# Altium schematic sheet pca10201_power_supply.SchDoc: =BoardTitle + ' - Power Supply'
size A3; Organization: Nordic Semiconductor; DocumentNumber: 8; SheetNumber: 8; SheetTotal: 10; CompanyName: Nordic Semiconductor; DocumentSize: A3
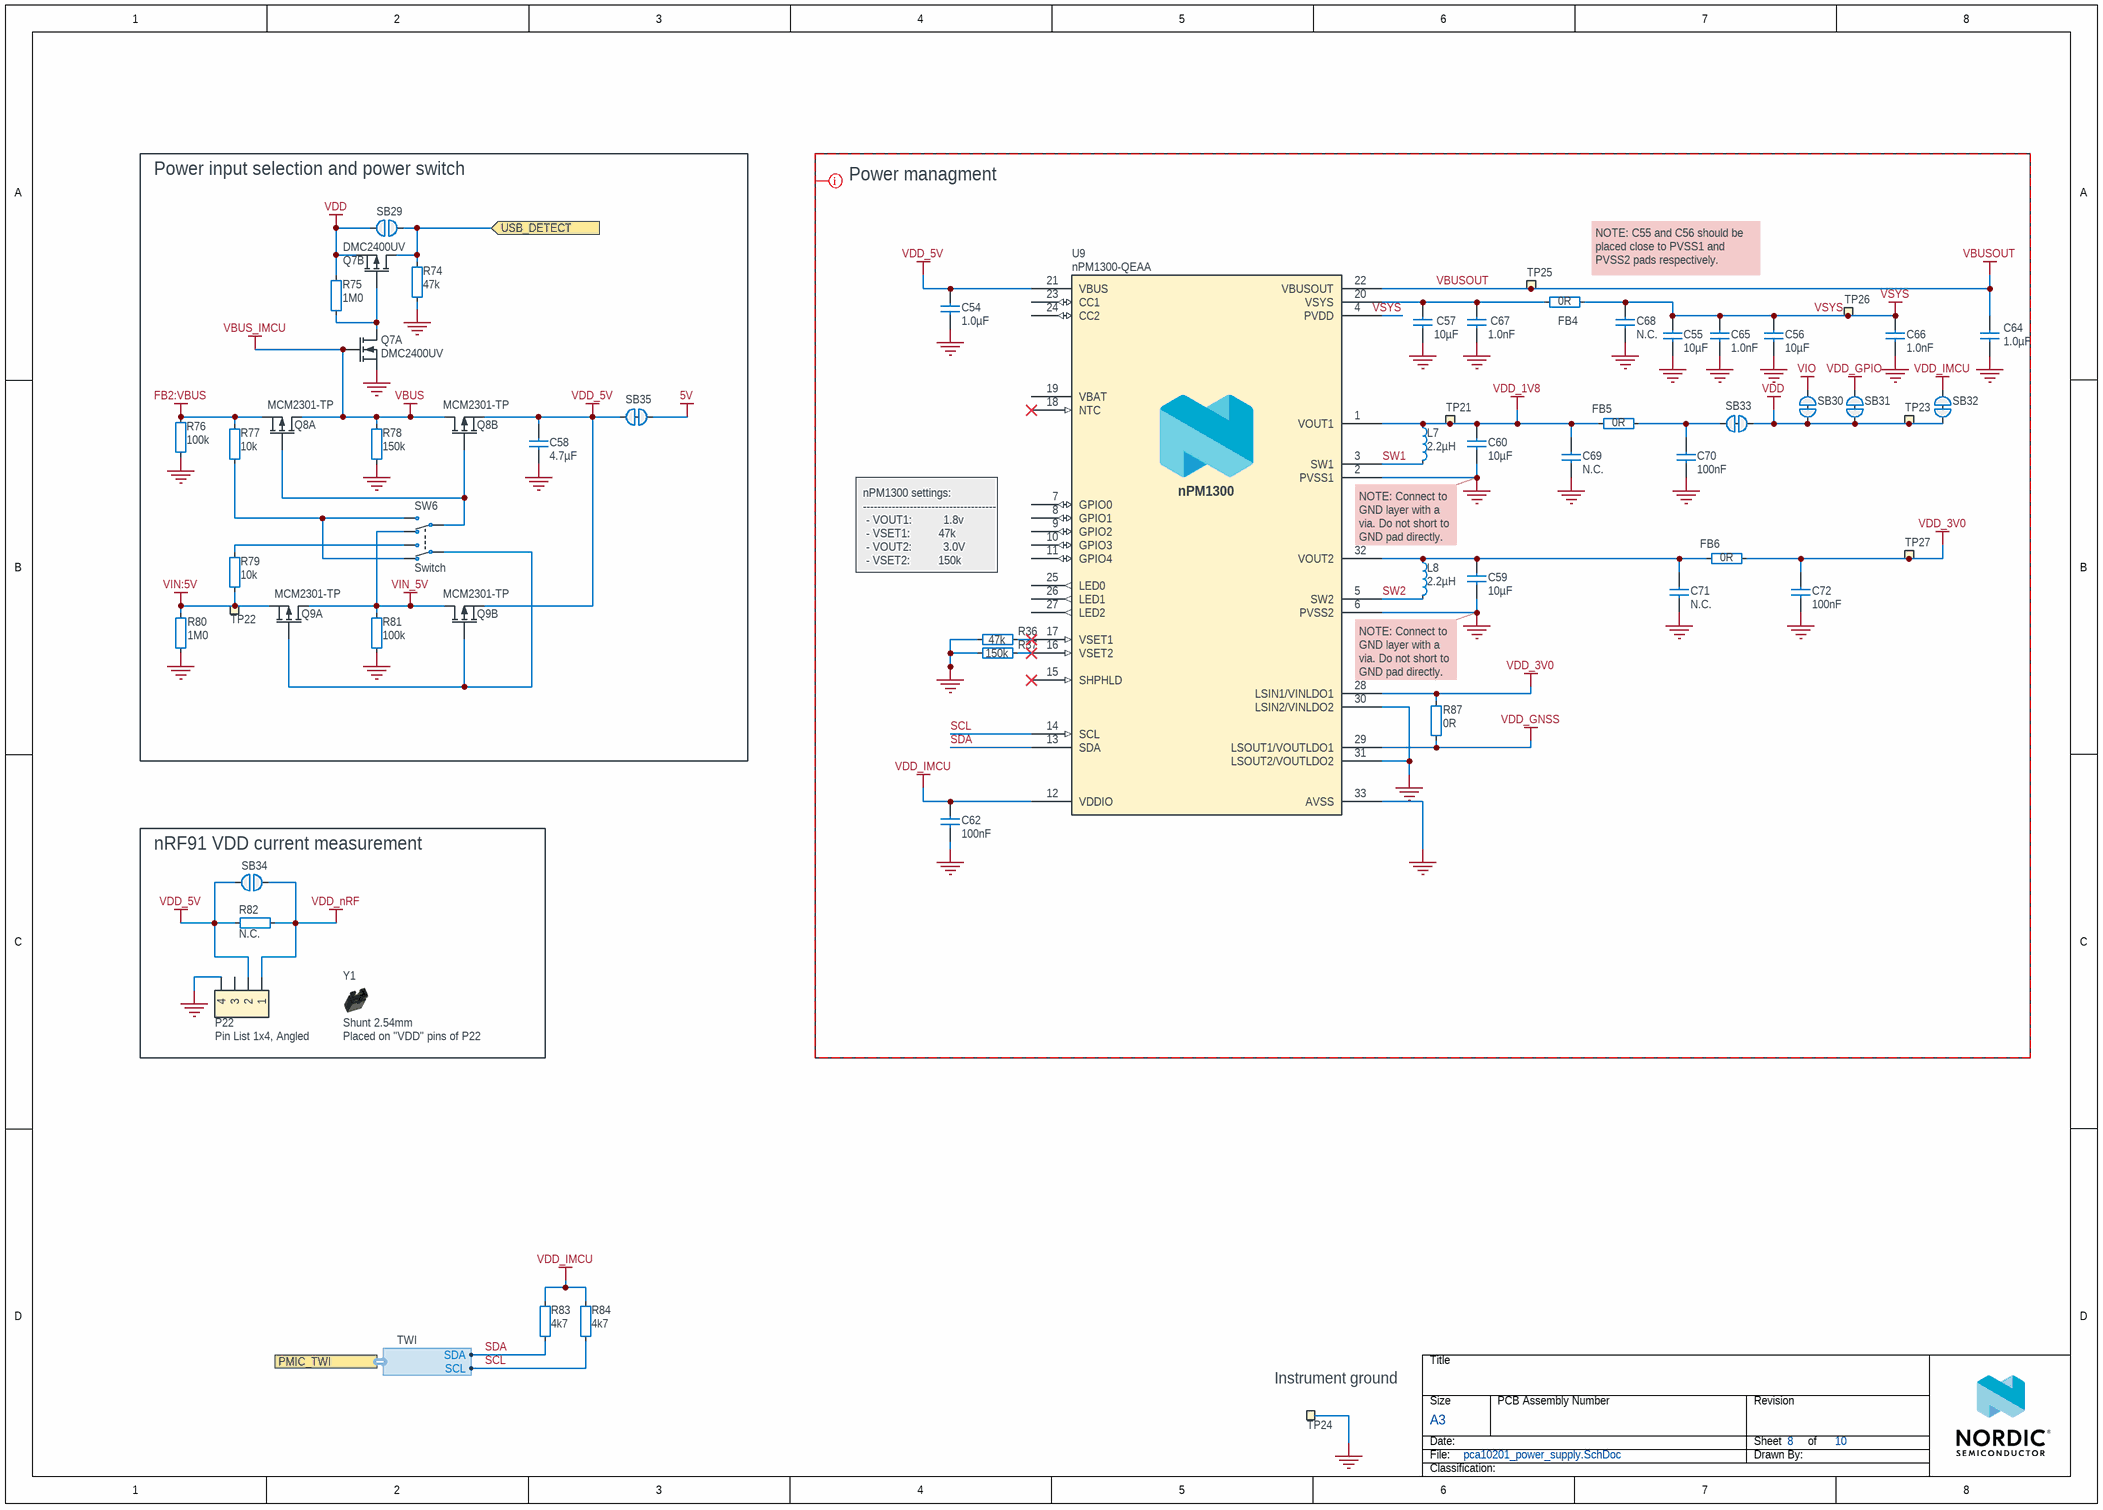
[diagram p0: pca10201_power_supply.SchDoc]

## Parts
C54  1.0µF  [CAPC1608X06L]
C55  10µF  [CAPC1608X06L]
C56  10µF  [CAPC1608X06L]
C57  10µF  [CAPC1608X06L]
C58  4.7µF  [CAPC1608X06L]
C59  10µF  [CAPC1608X06L]
C60  10µF  [CAPC1608X06L]
C62  100nF  [CAPC0603X03L_C]
C64  1.0µF  [CAPC1005X04L]
C65  1.0nF  [CAPC0603X03L_C]
C66  1.0nF  [CAPC0603X03L_C]
C67  1.0nF  [CAPC0603X03L_C]
C68  N.C.  [CAPC1608X06L_NC]
C69  N.C.  [CAPC1608X06L_NC]
C70  100nF  [CAPC1608X06L]
C71  N.C.  [CAPC1608X06L_NC]
C72  100nF  [CAPC1608X06L]
FB4  0R  [RESC2012X11L]
FB5  0R  [RESC2012X11L]
FB6  0R  [RESC2012X11L]
L7  2.2µH  [INDC2016X10N]
L8  2.2µH  [INDC2016X10N]
P22  Pin List 1x4, Angled  [LIST_ANG_1x4-SMD-2.54MM]
Q7  DMC2400UV  [SOTFL50P162X60-6N]  (parts A,B of 2)
Q8  MCM2301-TP  [DFN65P200X200X80_HS-6N]  (parts A,B of 2)
Q9  MCM2301-TP  [DFN65P200X200X80_HS-6N]  (parts A,B of 2)
R36  47k  [RESC0603X03L_C]
R37  150k  [RESC0603X03L_C]
R74  47k  [RESC0603X03L_C]
R75  1M0  [RESC0603X03L_C]
R76  100k  [RESC0603X03L_C]
R77  10k  [RESC0603X03L_C]
R78  150k  [RESC0603X03L_C]
R79  10k  [RESC0603X03L_C]
R80  1M0  [RESC0603X03L_C]
R81  100k  [RESC0603X03L_C]
R82  N.C.  [RESC1005X04L_NC]
R83  4k7  [RESC0603X03L_C]
R84  4k7  [RESC0603X03L_C]
R87  0R  [RESC0603X03L_C]
SB29  Solderbridge  [Solderbridge]  (value not drawn)  (no BOM)
SB30  Solderbridge  [Solderbridge_Shorted_Power]  (value not drawn)  (net tie, no BOM)
SB31  Solderbridge  [Solderbridge_Shorted_Power]  (value not drawn)  (net tie, no BOM)
SB32  Solderbridge  [Solderbridge_Shorted]  (value not drawn)  (net tie, no BOM)
SB33  Solderbridge  [Solderbridge_Shorted_Power]  (value not drawn)  (net tie, no BOM)
SB34  Solderbridge  [Solderbridge]  (value not drawn)  (no BOM)
SB35  Solderbridge  [Solderbridge_Shorted_Power]  (value not drawn)  (net tie, no BOM)
SW6  Switch  [JS102011JAQN]
TP21  Ø1.5mm,SMD  [TP_SMD_D1.5mm]  (value not drawn)  (no BOM)
TP22  Ø1.5mm,SMD  [TP_SMD_D1.5mm]  (value not drawn)  (no BOM)
TP23  Ø1.5mm,SMD  [TP_SMD_D1.5mm]  (value not drawn)  (no BOM)
TP24  TP  [TESTPAD-TH]  (value not drawn)  (no BOM)
TP25  Ø1.5mm,SMD  [TP_SMD_D1.5mm]  (value not drawn)  (no BOM)
TP26  Ø1.5mm,SMD  [TP_SMD_D1.5mm]  (value not drawn)  (no BOM)
TP27  Ø1.5mm,SMD  [TP_SMD_D1.5mm]  (value not drawn)  (no BOM)
U9  nPM1300-QEAA  [Nordic_QFN50P500X500X90-33N]
Y1  Shunt 2.54mm  Assembly: Placed on "VDD" pins of P22  [Shunt_2.54mm_Horizontal]

## Blocks framed on the sheet
Power input selection and power switch: C58 Q7-Q9 R74-R81 SB29 SB35 SW6 TP22
Power managment: C54-C57 C59 C60 C62 C64-C72 FB4-FB6 L7 L8 R36 R37 R87 SB30-SB33 TP21 TP23 TP25-TP27 U9
nRF91 VDD current measurement: P22 R82 SB34 Y1

## Ports
PMIC_TWI (harness TWI), USB_DETECT (in)

## Harnesses
TWI: SCL, SDA

## Nets
5V: SB35.2
FB2:VBUS: Q8.1(S1) R76.1 R77.1
GND: C54.1 C55.1 C56.1 C57.1 C58.1 C59.1 C60.1 C62.2 C64.1 C65.1 C66.1 C67.1 C68.1 C69.1 C70.1 C71.1 C72.1 P22.4 Q7.1(S1) R36.2 R37.2 R74.1 R76.2 R78.1 R80.2 R81.2 TP24.1 U9.2(PVSS1) U9.6(PVSS2) U9.30(LSIN2/VINLDO2) U9.31(LSOUT2/VOUTLDO2) U9.33(AVSS)
VBUS: Q7.2(G1) Q8.3(D2) Q8.6(D1) R78.2  [also labelled VBUS_IMCU]
VBUSOUT: C64.2 TP25.1 U9.22(VBUSOUT)
VDD: Q7.4(S2) R75.1 SB29.1 SB30.2 SB31.1 SB32.1 SB33.2 TP23.1
VDD_1V8: C60.2 C69.2 FB5.1 L7.1 TP21.1 U9.1(VOUT1)
VDD_3V0: C72.2 FB6.2 R87.1 TP27.1 U9.28(LSIN1/VINLDO1)
VDD_5V: C54.2 C58.2 P22.2 Q8.4(S2) Q9.4(S2) R82.2 SB34.2 SB35.1 U9.21(VBUS)
VDD_GNSS: R87.2 U9.29(LSOUT1/VOUTLDO1)
VDD_GPIO: SB31.2
VDD_IMCU: C62.1 R83.2 R84.2 SB32.2 U9.12(VDDIO)
VDD_nRF: P22.1 R82.1 SB34.1
VIN:5V: Q9.1(S1) R79.2 R80.1 TP22.1
VIN_5V: Q9.3(D2) Q9.6(D1) R81.1 SW6.6(N.C-2)
VIO: SB30.1
VSYS: C55.2 C56.2 C65.2 C66.2 C68.2 FB4.2 TP26.1 U9.4(PVDD)
SCL: R84.1 U9.14(SCL) ; port PMIC_TWI.SCL
SDA: R83.1 U9.13(SDA) ; port PMIC_TWI.SDA
SW1: L7.2 U9.3(SW1)
SW2: L8.2 U9.5(SW2)
USB_DETECT: Q7.3(D2) R74.2 SB29.2 ; port USB_DETECT
NetC57_2: C57.2 C67.2 FB4.1 U9.20(VSYS)
NetC59_2: C59.2 C71.2 FB6.1 L8.1 U9.32(VOUT2)
NetC70_2: C70.2 FB5.2 SB33.1
NetQ7_5: Q7.5(G2) Q7.6(D1) R75.2
NetQ8_2: Q8.2(G1) Q8.5(G2) SW6.5(COM-2)
NetQ9_2: Q9.2(G1) Q9.5(G2) SW6.2(COM-1)
NetR36_1: R36.1 U9.17(VSET1)
NetR37_1: R37.1 U9.16(VSET2)
NetR77_2: R77.2 SW6.3(N.C-1) SW6.4(N.O-2)
NetR79_1: R79.1 SW6.1(N.O-1)

Not connected (* = marked no-connect by the designer): P22 3; U9 7(GPIO0) 8(GPIO1) 9(GPIO2) 10(GPIO3) 11(GPIO4) 15(SHPHLD)* 18(NTC)* 19(VBAT) 23(CC1) 24(CC2) 25(LED0) 26(LED1) 27(LED2)

## Layout directives
CompClassName: nPM1300: GND, SCL, SDA, SW1, SW2, VBUSOUT, VDD, VDD_1V8, VDD_3V0, VDD_5V, VDD_GNSS, VDD_GPIO, VDD_IMCU, VIO, VSYS

## Notes on the sheet
- NOTE: C55 and C56 should be placed close to PVSS1 and PVSS2 pads respectively.
- nPM1300 settings:
  -------------------------------------
  - VOUT1:          1.8v
  - VSET1:	        47k
  - VOUT2:          3.0V
  - VSET2:	        150k
- NOTE: Connect to GND layer with a via. Do not short to GND pad directly.
- (near TP24) Instrument ground
- Title
- Size
- Date:
- File:
- A3
- PCB Assembly Number
- Sheet
- Drawn By:
- Revision
- of
- Classification:
- (in symbol nPM1300-QEAA) nPM1300

## Library data of the parts
C54 = C0603-1µ0-10V-X5R: Capacitor, Ceramic, 1.0µF 10V X5R 0603,±10%; Manufacturer: N.A.; Part number NEMS: 100200528; Component Status: Active; Pad Count: 2; Part Number: C0603-1µ0-10V-X5R; PartId: 100200528; Component Class: Capacitors; Author: getr; Manufacturer Part Number: N.A.; ComponentLink1URL: N.A.; ComponentLink1Description: Datasheet; ComponentLink2URL: N.A.; ComponentLink2Description: Supplier link; HelpURL: N.A.; LatestRevisionDate: 2022-10-06; Published: 2022-10-06; Footprint Doc: 0603; Value: 1.0µF; Note: 10V; Supplier 1: N.A.; Supplier Part Number 1: N.A.; Supplier 2: N.A.; Supplier Part Number 2: N.A.; Artikkelnr Noca: N.A.; Part number IPS: N.A.; Part number Norautron: N.A.
C55-C57 C59 C60 = C0603-10µ-10V-X7T-GRM188D71A106MA73: Capacitor, X7T, ±20%, 10V; Manufacturer: Murata; Manufacturer Part Number: GRM188D71A106MA73D; Part number IPS: 00000004696; Part number NEMS: 100200414; Component Status: Active; Pad Count: 2; Note: 10VDC; Artikkelnr Noca: N.A.; Part Number: C0603-10µ-10V-X7T-GRM188D71A106MA73; PartId: 100200414; Component Class: Capacitors; Author: rsk; ComponentLink1URL: N.A.; ComponentLink1Description: Datasheet; ComponentLink2URL: N.A.; ComponentLink2Description: Supplier link; HelpURL: https://no.mouser.com/datasheet/2/281/murata_03052018_GRM_Series_1-1310166.pdf; LatestRevisionDate: 2021-07-22; Published: 2018-09-11; Footprint Doc: 0603; Value: 10µF; Supplier 1: Digi-Key; Supplier Part Number 1: 490-7200-1-ND; Supplier 2: Mouser; Supplier Part Number 2: 81-GRM188D71A106MA3D; Part number Norautron: N.A.
C58 = C0603-4µ7-10V-X5R: Capacitor, Ceramic, X5R, ±10%, 10V; Manufacturer: N.A.; Part number Norautron: 262081761; Part number NEMS: 100200479; Pad Count: 2; Component Status: Active; Part Number: C0603-4µ7-10V-X5R; Manufacturer Part Number: N.A.; ComponentLink1URL: N.A.; ComponentLink1Description: Datasheet; ComponentLink2URL: N.A.; ComponentLink2Description: Supplier link; HelpURL: N.A.; Footprint Doc: 0603; LatestRevisionDate: 2021-07-22; Published: 2021-07-22; Value: 4.7µF; Note: 10V; Supplier 1: N.A.; Supplier Part Number 1: N.A.; Supplier 2: N.A.; Supplier Part Number 2: N.A.; Artikkelnr Noca: N.A.; Part number IPS: N.A.; Component Class: Capacitors; PartId: 100200479; Author: rubr
C62 = C0201-100n: Capacitor, X5R, ±10%, 100nF, 16V; Manufacturer: N.A.; Part number IPS: 00000001248, 00000002505; Part number Norautron: 262071862; Part number NEMS: 100200078; Pad Count: 2; Component Status: Active; Part Number: C0201-100n; Value: 100nF; Footprint Doc: 0201; Component Class: Capacitors; Author: rsk; PartId: 100200078; Manufacturer Part Number: N.A.; ComponentLink1URL: N.A.; ComponentLink1Description: Datasheet; ComponentLink2URL: N.A.; ComponentLink2Description: Supplier link; HelpURL: N.A.; LatestRevisionDate: 2024-06-27; Published: 2014-11-13; Note: 16V; Supplier 1: N.A.; Supplier Part Number 1: N.A.; Supplier 2: N.A.; Supplier Part Number 2: N.A.; Artikkelnr Noca: N.A.
C64 = C0402-1µ0-10V-X5R: Capacitor, Ceramic, X5R, ±10%, 10V; Manufacturer: N.A.; Part number NEMS: 100200482; Pad Count: 2; Component Status: Active; Part Number: C0402-1µ0-10V-X5R; Manufacturer Part Number: N.A.; Footprint Doc: 0402; LatestRevisionDate: 2021-07-22; Published: 2021-07-22; Value: 1.0µF; Note: 10V; Artikkelnr Noca: N.A.; Part number IPS: N.A.; ComponentLink1URL: N.A.; ComponentLink1Description: Datasheet; ComponentLink2URL: N.A.; ComponentLink2Description: Supplier link; HelpURL: N.A.; Supplier 1: N.A.; Supplier Part Number 1: N.A.; Supplier 2: N.A.; Supplier Part Number 2: N.A.; Component Class: Capacitors; PartId: 100200482; Author: rubr; Part number Norautron: N.A.
C65-C67 = C0201-1n0: Capacitor, X7R, ±10%, 25V; Manufacturer: N.A.; Part number IPS: 00000003206; Part number NEMS: 100200056; Component Status: Active; Pad Count: 2; Note: 16V; Part Number: C0201-1n0; PartId: 100200056; Component Class: Capacitors; Author: rsk; Manufacturer Part Number: N.A.; ComponentLink1URL: N.A.; ComponentLink1Description: Datasheet; ComponentLink2URL: N.A.; ComponentLink2Description: Supplier link; HelpURL: N.A.; LatestRevisionDate: 2020-10-13; Published: 2014-11-13; Footprint Doc: 0201; Value: 1.0nF; Supplier 1: N.A.; Supplier Part Number 1: N.A.; Supplier 2: N.A.; Supplier Part Number 2: N.A.; Artikkelnr Noca: N.A.; Part number Norautron: N.A.
C68 C69 C71 = C0603-N.C.: Not mounted; Manufacturer: N.A.; Part number NEMS: 100200195; Component Status: Active; Pad Count: 2; Note: Chip Cap; Assembly: Not mounted; Part Number: C0603-N.C.; PartId: 100200195; Component Class: Capacitors; Author: rsk; Manufacturer Part Number: N.A.; ComponentLink1URL: N.A.; ComponentLink1Description: Datasheet; ComponentLink2URL: N.A.; ComponentLink2Description: Supplier link; HelpURL: N.A.; Footprint Doc: 0603; LatestRevisionDate: 2009-05-08; Published: 2009-05-08; Value: N.C.; Supplier 1: N.A.; Supplier Part Number 1: N.A.; Supplier 2: N.A.; Supplier Part Number 2: N.A.; Artikkelnr Noca: N.A.; Part number IPS: N.A.; Part number Norautron: N.A.
C70 C72 = C0603-100n: Chip Cap 0603; Manufacturer: N.A.; Part number NEMS: 100200265; Component Status: Active; Pad Count: 2; Note: Chip Cap 1%; Part Number: C0603-100n; PartId: 100200265; Component Class: Capacitors; Author: rsk; Manufacturer Part Number: N.A.; ComponentLink1URL: N.A.; ComponentLink1Description: Datasheet; ComponentLink2URL: N.A.; ComponentLink2Description: Supplier link; HelpURL: N.A.; Footprint Doc: 0603; LatestRevisionDate: 2009-05-08; Published: 2009-05-08; Value: 100nF; Supplier 1: N.A.; Supplier Part Number 1: N.A.; Supplier 2: N.A.; Supplier Part Number 2: N.A.; Artikkelnr Noca: N.A.; Part number IPS: N.A.; Part number Norautron: N.A.
FB4-FB6 = R0805-0R: Resistor, ±5%, 0.125W; Manufacturer: N.A.; Part number NEMS: 100100375; Component Status: Active; Pad Count: 2; Note: Chip Res 5%; Artikkelnr Noca: 27089000; Part Number: R0805-0R; PartId: 100100375; Component Class: Resistors; Author: rsk; Manufacturer Part Number: N.A.; ComponentLink1URL: N.A.; ComponentLink1Description: Datasheet; ComponentLink2URL: N.A.; ComponentLink2Description: Supplier link; HelpURL: N.A.; Footprint Doc: 0805; LatestRevisionDate: 2013-06-04; Published: 2009-05-08; Value: 0R; Supplier 1: N.A.; Supplier Part Number 1: N.A.; Supplier 2: N.A.; Supplier Part Number 2: N.A.; Part number IPS: N.A.; Part number Norautron: N.A.
L7 L8 = L0806-2µ2-2500mA-73mOhm-CIGT201610EH2R2MNE: Inductor, Irms=2.5A, Isat=2.9A, ±20%, DCR=73mΩ; Manufacturer: Samsung Electro-Mechanics America; Part number Norautron: 26521789; Part number NEMS: 100300400; Component Status: Active; Pad Count: 2; Note: Unshielded Thin Film Inductor; Artikkelnr Noca: N.A.; Part Number: L0806-2µ2-2500mA-73mOhm-CIGT201610EH2R2MNE; PartId: 100300400; Component Class: Inductors; Author: rsk; Manufacturer Part Number: CIGT201610EH2R2MNE; ComponentLink1URL: https://media.digikey.com/pdf/Data%20Sheets/Samsung%20PDFs/CIGT201610EH2R2MNE_Spec.pdf; ComponentLink1Description: Datasheet; ComponentLink2URL: https://www.digikey.com/en/products/detail/samsung-electro-mechanics/CIGT201610EH2R2MNE/7041223?s=N4IgTCBcDaIMIEkDiAVMAGAjANk%2BgogBJgBKYAsgHL4gC6AvkA; ComponentLink2Description: Supplier link; HelpURL: http://product.samsungsem.com/pi/CIGT201610EH2R2MN.do; LatestRevisionDate: 2022-09-07; Published: 2021-02-03; Footprint Doc: 0806; Value: 2.2µH; Supplier 1: Digi-Key; Supplier Part Number 1: 1276-6901-1-ND; Supplier 2: Mouser; Supplier Part Number 2: 187-CIGT201610EH2R2M; Part number IPS: N.A.
P22 = Pin List Ang 1x4 SMD, 2.54mm: Pin List 1x4, 2.54mm (100mil), Right Angled, SMD; Manufacturer: WCON; Manufacturer Part Number: 1125B-1104S0Z135CR04; Part number NEMS: 100500358; Note: (Replaced 1125B-1104S0Z135CR02); Artikkelnr Noca: N.A.; Pad Count: 4; Component Status: Active; System: Connector; Part Number: Pin List Ang 1x4 SMD, 2.54mm; ComponentLink1URL: N.A.; ComponentLink1Description: Datasheet; ComponentLink2URL: N.A.; ComponentLink2Description: Supplier link; HelpURL: N.A.; Footprint Doc: LIST_ANG_1x4-SMD-2.54MM; LatestRevisionDate: 2024-02-02; Published: 2015-01-23; Value: Pin List 1x4, Angled; Supplier 1: Cabcon; Supplier Part Number 1: 1125B-1104S0Z135CR04; Supplier 2: N.A.; Supplier Part Number 2: N.A.; Part number IPS: N.A.; PartId: 100500358; Component Class: Connectors; Author: rsk; Part number Norautron: N.A.
Q7 = DMC2400UV: Dual N & P Ch MOFET, 1.03A/0.7A, 480mOhm, 450mW; Manufacturer: Diodes Incorporated; Part number IPS: 00000007803; Part number NEMS: 101300117; Note: Dual N & P Channel Digital FET; Artikkelnr Noca: N.A.; Pad Count: 6; Component Status: Active; Part Number: DMC2400UV; Manufacturer Part Number: DMC2400UV; LatestRevisionDate: 2016-01-18; Published: 2016-01-18; Value: DMC2400UV; Footprint Doc: SOT-563; ComponentLink1URL: N.A.; ComponentLink1Description: Datasheet; ComponentLink2URL: N.A.; ComponentLink2Description: Supplier link; HelpURL: http://www.diodes.com/_files/datasheets/DMC2400UV.pdf; Supplier 1: Digi-Key; Supplier Part Number 1: DMC2400UV-7DICT-ND; Supplier 2: N.A.; Supplier Part Number 2: N.A.; PartId: 101300117; Component Class: Semiconductors; Author: rsk; Part number Norautron: N.A.
Q8 Q9 = MCM2301-TP: Dual P-Channel MOFET, 3.8A, 90mOhm max, 1.4W; Manufacturer: Micro Commercial Components; Part number NEMS: 101300199; Note: N.A.; Pad Count: 6; Component Status: Active; Part Number: MCM2301-TP; Manufacturer Part Number: MCM2301-TP; ComponentLink1URL: https://www.mccsemi.com/pdf/Products/MCM2301(DFN2020-6L).pdf; ComponentLink1Description: Datasheet; ComponentLink2URL: https://www.digikey.com/en/products/detail/micro-commercial-co/MCM2301-TP/9655971; ComponentLink2Description: Supplier link; HelpURL: https://www.mccsemi.com/product-detail/MCM2301; Footprint Doc: VDFN-6; LatestRevisionDate: 2022-12-27; Published: 2022-12-27; Value: MCM2301-TP; Supplier 1: Digi-Key; Supplier Part Number 1: MCM2301-TPMSCT-ND; Supplier 2: Mouser; Supplier Part Number 2: 833-MCM2301-TP; Artikkelnr Noca: N.A.; Part number IPS: N.A.; Component Class: Semiconductors; Author: rubr; Part number Norautron: N.A.; PartId: 101300199
R36 = R0201-47k: Resistor, ±1%, 0.05W; Manufacturer: N.A.; Part number IPS: 00000001423; Part number NEMS: 100100076; Component Status: Active; Pad Count: 2; Note: Chip Res 1%; Part Number: R0201-47k; PartId: 100100076; Component Class: Resistors; Author: rsk; Manufacturer Part Number: N.A.; ComponentLink1URL: N.A.; ComponentLink1Description: Datasheet; ComponentLink2URL: N.A.; ComponentLink2Description: Supplier link; HelpURL: N.A.; LatestRevisionDate: 2014-11-13; Published: 2014-11-13; Footprint Doc: 0201; Value: 47k; Supplier 1: N.A.; Supplier Part Number 1: N.A.; Supplier 2: N.A.; Supplier Part Number 2: N.A.; Artikkelnr Noca: N.A.; Part number Norautron: N.A.
R37 = R0201-150k: Resistor, ±1%, 0.05W; Manufacturer: N.A.; Part number IPS: 00000001422; Part number NEMS: 100100082; Component Status: Active; Pad Count: 2; Note: Chip Res 1%; Part Number: R0201-150k; PartId: 100100082; Component Class: Resistors; Author: rsk; Manufacturer Part Number: N.A.; ComponentLink1URL: N.A.; ComponentLink1Description: Datasheet; ComponentLink2URL: N.A.; ComponentLink2Description: Supplier link; HelpURL: N.A.; LatestRevisionDate: 2014-11-13; Published: 2014-11-13; Footprint Doc: 0201; Value: 150k; Supplier 1: N.A.; Supplier Part Number 1: N.A.; Supplier 2: N.A.; Supplier Part Number 2: N.A.; Artikkelnr Noca: N.A.; Part number Norautron: N.A.
R74 = R0201-47k: Resistor, ±1%, 0.05W; Manufacturer: N.A.; Part number IPS: 00000001423; Part number NEMS: 100100076; Note: Chip Res 1%; Pad Count: 2; Component Status: Active; Part Number: R0201-47k; Manufacturer Part Number: N.A.; ComponentLink1URL: N.A.; ComponentLink1Description: Datasheet; ComponentLink2URL: N.A.; ComponentLink2Description: Supplier link; HelpURL: N.A.; Footprint Doc: 0201; LatestRevisionDate: 2014-11-13; Published: 2014-11-13; Value: 47k; Artikkelnr Noca: N.A.; Supplier 1: N.A.; Supplier Part Number 1: N.A.; Supplier 2: N.A.; Supplier Part Number 2: N.A.; PartId: 100100076; Component Class: Resistors; Author: rsk; Part number Norautron: N.A.
R75 R80 = R0201-1M0: Resistor, ±1%, 0.05W; Manufacturer: N.A.; Part number IPS: 00000001418; Part number Norautron: 26107108; Part number NEMS: 100100093; Note: Chip Res 1%; Pad Count: 2; Component Status: Active; Part Number: R0201-1M0; Manufacturer Part Number: N.A.; ComponentLink1URL: N.A.; ComponentLink1Description: Datasheet; ComponentLink2URL: N.A.; ComponentLink2Description: Supplier link; HelpURL: N.A.; Footprint Doc: 0201; LatestRevisionDate: 2014-11-13; Published: 2014-11-13; Value: 1M0; Artikkelnr Noca: N.A.; Supplier 1: N.A.; Supplier Part Number 1: N.A.; Supplier 2: N.A.; Supplier Part Number 2: N.A.; PartId: 100100093; Component Class: Resistors; Author: rsk
R76 R81 = R0201-100k: Resistor, ±1%, 0.05W; Manufacturer: N.A.; Part number IPS: 00000001419; Part number Norautron: 26108487; Part number NEMS: 100100080; Note: Chip Res 1%; Pad Count: 2; Component Status: Active; Part Number: R0201-100k; Manufacturer Part Number: N.A.; LatestRevisionDate: 2014-11-13; Published: 2014-11-13; Value: 100k; Artikkelnr Noca: N.A.; Footprint Doc: 0201; ComponentLink1URL: N.A.; ComponentLink1Description: Datasheet; ComponentLink2URL: N.A.; ComponentLink2Description: Supplier link; HelpURL: N.A.; Supplier 1: N.A.; Supplier Part Number 1: N.A.; Supplier 2: N.A.; Supplier Part Number 2: N.A.; Component Class: Resistors; PartId: 100100080; Author: rsk
R77 R79 = R0201-10k: Resistor, ±1%, 0.05W; Manufacturer: N.A.; Part number IPS: 00000001255; Part number Norautron: 26107101; Part number NEMS: 100100065; Note: Chip Res 1%; Pad Count: 2; Component Status: Active; Part Number: R0201-10k; Manufacturer Part Number: N.A.; ComponentLink1URL: N.A.; ComponentLink1Description: Datasheet; ComponentLink2URL: N.A.; ComponentLink2Description: Supplier link; HelpURL: N.A.; Footprint Doc: 0201; LatestRevisionDate: 2014-11-13; Published: 2014-11-13; Value: 10k; Supplier 1: N.A.; Supplier Part Number 1: N.A.; Supplier 2: N.A.; Supplier Part Number 2: N.A.; Artikkelnr Noca: N.A.; Component Class: Resistors; PartId: 100100065; Author: rsk
R78 = R0201-150k: Resistor, ±1%, 0.05W; Manufacturer: N.A.; Part number IPS: 00000001422; Part number NEMS: 100100082; Note: Chip Res 1%; Pad Count: 2; Component Status: Active; Part Number: R0201-150k; Manufacturer Part Number: N.A.; ComponentLink1URL: N.A.; ComponentLink1Description: Datasheet; ComponentLink2URL: N.A.; ComponentLink2Description: Supplier link; HelpURL: N.A.; Footprint Doc: 0201; LatestRevisionDate: 2014-11-13; Published: 2014-11-13; Value: 150k; Artikkelnr Noca: N.A.; Supplier 1: N.A.; Supplier Part Number 1: N.A.; Supplier 2: N.A.; Supplier Part Number 2: N.A.; PartId: 100100082; Component Class: Resistors; Author: rsk; Part number Norautron: N.A.
R82 = R0402-N.C.: Not mounted; Manufacturer: N.A.; Part number NEMS: 100100281; Note: Chip Res; Assembly: Not mounted; Pad Count: 2; Component Status: Active; Part Number: R0402-N.C.; Manufacturer Part Number: N.A.; LatestRevisionDate: 2009-05-08; Published: 2009-05-08; Value: N.C.; Artikkelnr Noca: N.A.; Footprint Doc: 0402; Part number IPS: N.A.; ComponentLink1URL: N.A.; ComponentLink1Description: Datasheet; ComponentLink2URL: N.A.; ComponentLink2Description: Supplier link; HelpURL: N.A.; Supplier 1: N.A.; Supplier Part Number 1: N.A.; Supplier 2: N.A.; Supplier Part Number 2: N.A.; PartId: 100100281; Component Class: Resistors; Author: rsk; Part number Norautron: N.A.
R83 R84 = R0201-4k7: Resistor, ±1%, 0.05W; Manufacturer: N.A.; Part number IPS: 00000001706; Part number NEMS: 100100061; Note: Chip Res 1%; Pad Count: 2; Component Status: Active; Part Number: R0201-4k7; Manufacturer Part Number: N.A.; Footprint Doc: 0201; LatestRevisionDate: 2014-11-13; Published: 2014-11-13; Value: 4k7; Artikkelnr Noca: N.A.; ComponentLink1URL: N.A.; ComponentLink1Description: Datasheet; ComponentLink2URL: N.A.; ComponentLink2Description: Supplier link; HelpURL: N.A.; Supplier 1: N.A.; Supplier Part Number 1: N.A.; Supplier 2: N.A.; Supplier Part Number 2: N.A.; PartId: 100100061; Component Class: Resistors; Author: rsk; Part number Norautron: N.A.
R87 = R0201-0R: Resistor, ±5%, 0.05W; Manufacturer: N.A.; Part number IPS: 00000003245; Part number NEMS: 100100001; Component Status: Active; Pad Count: 2; Note: Chip Res 5%; Part Number: R0201-0R; PartId: 100100001; Component Class: Resistors; Author: rsk; Manufacturer Part Number: N.A.; ComponentLink1URL: N.A.; ComponentLink1Description: Datasheet; ComponentLink2URL: N.A.; ComponentLink2Description: Supplier link; HelpURL: N.A.; LatestRevisionDate: 2017-11-09; Published: 2014-11-13; Footprint Doc: 0201; Value: 0R; Supplier 1: N.A.; Supplier Part Number 1: N.A.; Supplier 2: N.A.; Supplier Part Number 2: N.A.; Artikkelnr Noca: N.A.; Part number Norautron: N.A.
SB29 SB34 = Solderbridge: Manufacturer: N.A.; Part number NEMS: 100500458; Pad Count: 2; Component Status: Active; System: Connector; Part Number: Solderbridge; Manufacturer Part Number: N.A.; LatestRevisionDate: 2009-12-14; Published: 2009-12-14; Value: Solderbridge; Note: N.A.; Artikkelnr Noca: N.A.; Footprint Doc: Solderbridge; Part number IPS: N.A.; ComponentLink1URL: N.A.; ComponentLink1Description: Datasheet; ComponentLink2URL: N.A.; ComponentLink2Description: Supplier link; HelpURL: N.A.; Supplier 1: N.A.; Supplier Part Number 1: N.A.; Supplier 2: N.A.; Supplier Part Number 2: N.A.; PartId: 100500458; Component Class: Connectors; Author: rsk; Part number Norautron: N.A.
SB30 SB31 SB33 SB35 = Solderbridge Shorted Power: Shorted Solderbridge Power; Manufacturer: N.A.; Part number NEMS: 100500460; Pad Count: 2; Component Status: Active; System: Connector; Part Number: Solderbridge Shorted Power; Manufacturer Part Number: N.A.; LatestRevisionDate: 2012-08-07; Published: 2012-08-07; Value: Solderbridge; Note: N.A.; Artikkelnr Noca: N.A.; Footprint Doc: Solderbridge_Shorted_Power; Part number IPS: N.A.; ComponentLink1URL: N.A.; ComponentLink1Description: Datasheet; ComponentLink2URL: N.A.; ComponentLink2Description: Supplier link; HelpURL: N.A.; Supplier 1: N.A.; Supplier Part Number 1: N.A.; Supplier 2: N.A.; Supplier Part Number 2: N.A.; PartId: 100500460; Component Class: Connectors; Author: rsk; Part number Norautron: N.A.
SB32 = Solderbridge Shorted: Shorted Solderbridge; Manufacturer: N.A.; Part number NEMS: 100500459; Pad Count: 2; Component Status: Active; System: Connector; Part Number: Solderbridge Shorted; Manufacturer Part Number: N.A.; LatestRevisionDate: 2012-08-07; Published: 2012-08-07; Value: Solderbridge; Note: N.A.; Artikkelnr Noca: N.A.; Footprint Doc: Solderbridge_Shorted; Part number IPS: N.A.; ComponentLink1URL: N.A.; ComponentLink1Description: Datasheet; ComponentLink2URL: N.A.; ComponentLink2Description: Supplier link; HelpURL: N.A.; Supplier 1: N.A.; Supplier Part Number 1: N.A.; Supplier 2: N.A.; Supplier Part Number 2: N.A.; PartId: 100500459; Component Class: Connectors; Author: rsk; Part number Norautron: N.A.
SW6 = Switch-Slide-RA-J-Lead-DPDT-8.5x3.5mm_C&K: SMD slide Switch (ON-ON); Manufacturer: C&K; Manufacturer Part Number: JS202011JAQN; Part number IPS: 00000007811; Part number NEMS: 101500037; Note: N.A.; Pad Count: 6; Component Status: Active; Part Number: Switch-Slide-RA-J-Lead-DPDT-8.5x3.5mm_C&K; Footprint Doc: Switch-Slide-RA-J-Lead-DPDT-8.5x3.5mm; LatestRevisionDate: 2017-02-01; Published: 2016-09-15; Value: Switch; Artikkelnr Noca: N.A.; ComponentLink1URL: N.A.; ComponentLink1Description: Datasheet; ComponentLink2URL: N.A.; ComponentLink2Description: Supplier link; HelpURL: http://www.ck-components.com/media/1422/js.pdf; Supplier 1: Digi-Key; Supplier Part Number 1: CKN10722CT-ND; Supplier 2: Mouser; Supplier Part Number 2: 611-JS202011JAQN; PartId: 101500037; Component Class: Switches; Author: rsk; Part number Norautron: N.A.
TP21-TP23 TP25-TP27 = TP_SMD_Ø1.5MM: 1.5mm circular SMD testpad; Manufacturer: Nordic Semiconductor; Manufacturer Part Number: N.A.; Part number NEMS: 100500477; Pad Count: 1; Component Status: Active; Part Number: TP_SMD_Ø1.5MM; ComponentLink1URL: N.A.; ComponentLink1Description: Datasheet; ComponentLink2URL: N.A.; ComponentLink2Description: Supplier link; HelpURL: N.A.; Footprint Doc: TP_SMD_Ø1.5mm; LatestRevisionDate: 2021-03-05; Published: 2016-06-02; Value: Ø1.5mm,SMD; Note: N.A.; Supplier 1: N.A.; Supplier Part Number 1: N.A.; Supplier 2: N.A.; Supplier Part Number 2: N.A.; Artikkelnr Noca: N.A.; Part number IPS: N.A.; Component Class: Connectors; PartId: 100500477; Author: rsk; Part number Norautron: N.A.
TP24 = Testpoint TH: Testpoint, through hole; Manufacturer: N.A.; Part number NEMS: 100500464; Pad Count: 1; Component Status: Active; Part Number: Testpoint TH; Manufacturer Part Number: N.A.; Footprint Doc: TESTPAD-TH; LatestRevisionDate: 2009-12-12; Published: 2009-12-12; Value: TP; Note: N.A.; Artikkelnr Noca: N.A.; Part number IPS: N.A.; ComponentLink1URL: N.A.; ComponentLink1Description: Datasheet; ComponentLink2URL: N.A.; ComponentLink2Description: Supplier link; HelpURL: N.A.; Supplier 1: N.A.; Supplier Part Number 1: N.A.; Supplier 2: N.A.; Supplier Part Number 2: N.A.; PartId: 100500464; Component Class: Connectors; Author: rsk; Part number Norautron: N.A.
U9 = nPM1300-QEAA: Li-Ion/Li-Polymer USB-C battery charger with high efficiency buck regulators, LDOs or load switches, LED drivers, TWI and VBUSOUT; Manufacturer: Nordic Semiconductor; Part number NEMS: 102000291; Component Status: Active; Pad Count: 33; Note: N.A.; Part Number: nPM1300-QEAA; PartId: 102000291; Component Class: Nordic_Devices; Author: eisk; Manufacturer Part Number: nPM1300-QEAA; ComponentLink1URL: N.A.; ComponentLink1Description: Datasheet; ComponentLink2URL: N.A.; ComponentLink2Description: Supplier link; HelpURL: N.A.; LatestRevisionDate: 2023-05-25; Published: 2022-02-17; Footprint Doc: QFN-32; Value: nPM1300-QEAA; Supplier 1: Nordic Semiconductor; Supplier Part Number 1: nPM1300-QEAA; Supplier 2: N.A.; Supplier Part Number 2: N.A.; Artikkelnr Noca: N.A.; Part number IPS: N.A.; Part number Norautron: N.A.
Y1 = SHUNT JUMPER 2.54mm Black Tin: Shunt Jumper 2.54mm Black, open top; Manufacturer: WCON; Manufacturer Part Number: 3710-6001OS0B05; Part number NEMS: 100500728; Note: N.A.; Pad Count: 2; Component Status: Active; System: Connector; Part Number: SHUNT JUMPER 2.54mm Black Tin; ComponentLink1URL: N.A.; ComponentLink1Description: Datasheet; ComponentLink2URL: N.A.; ComponentLink2Description: Supplier link; HelpURL: N.A.; Footprint Doc: SHUNT JUMPER 2.54mm; LatestRevisionDate: 2024-08-02; Published: 2021-06-28; Value: Shunt 2.54mm; Supplier 1: Cabcon; Supplier Part Number 1: 3710-6001OS0B05; Supplier 2: N.A.; Supplier Part Number 2: N.A.; Artikkelnr Noca: N.A.; Part number IPS: N.A.; PartId: 100500728; Component Class: Connectors; Author: masi; Part number Norautron: N.A.